# EAGLE schematic Domino Qi (EAGLE 6.5.0)
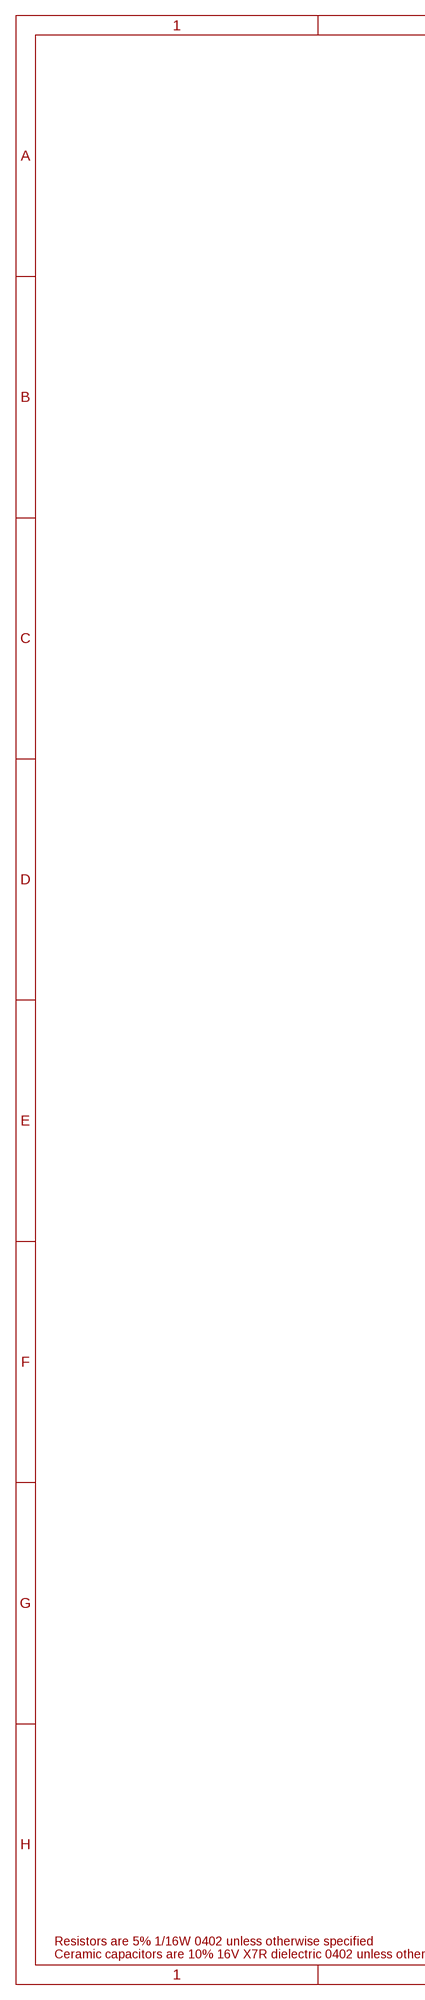
[diagram p0: schematic, sheet 1, part 1 of 2]
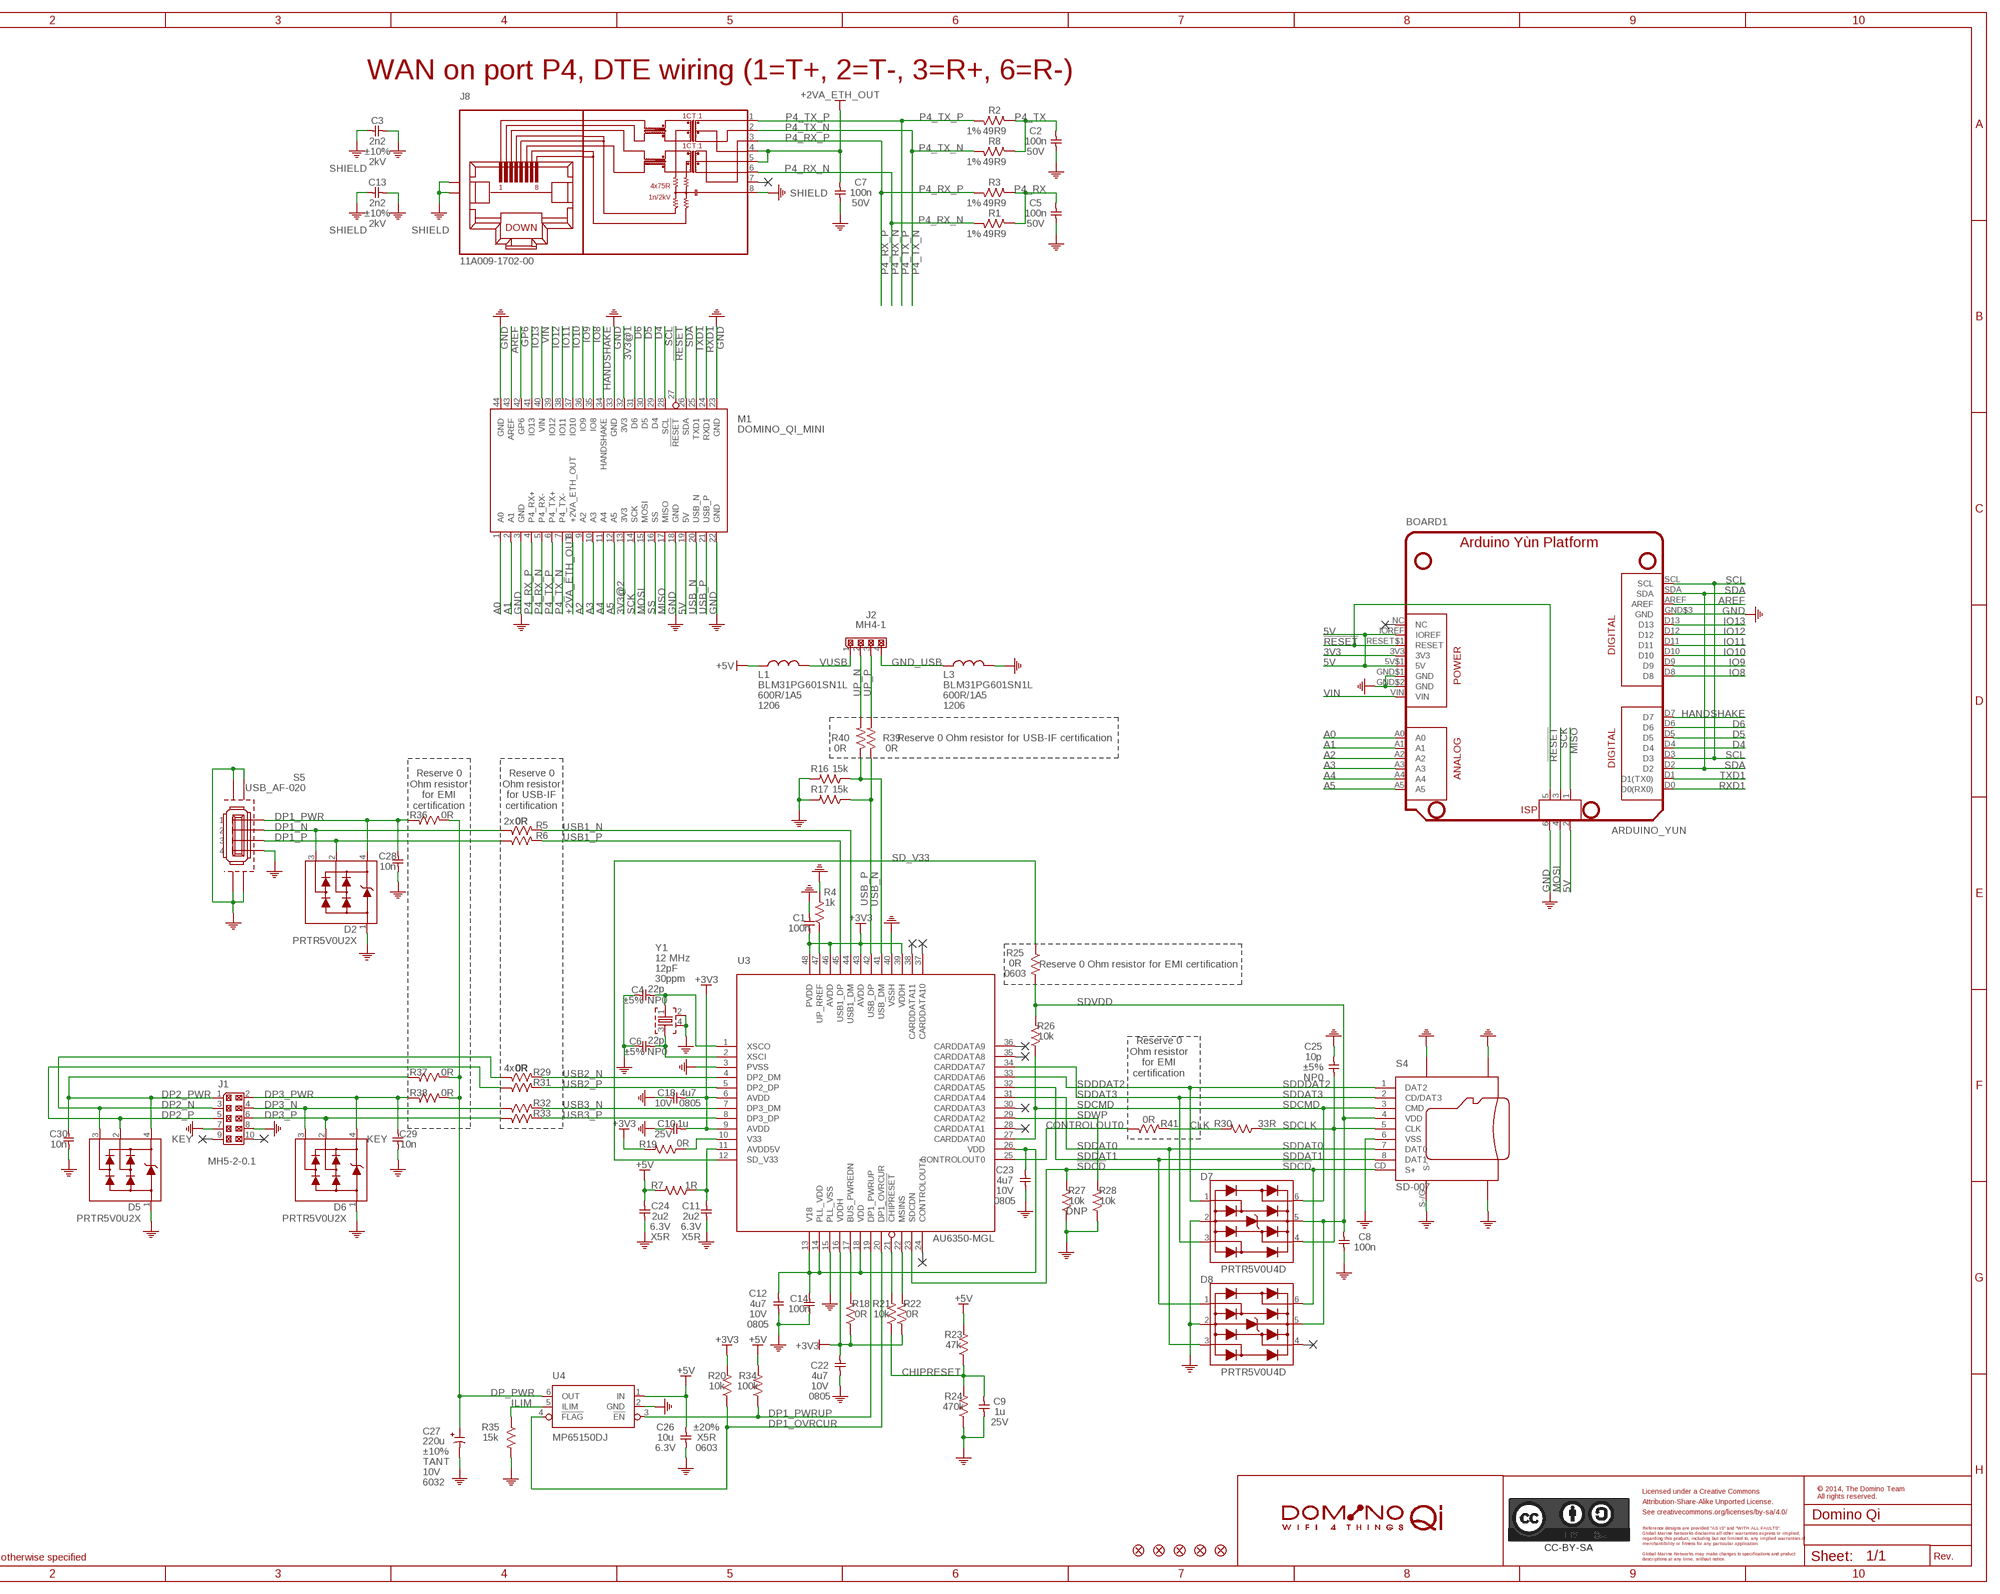
[diagram p1: schematic, sheet 1, part 2 of 2]
PORT1 (NC): BOM: EXCLUDE
PORT2 (NC): BOM: EXCLUDE
PORT3 (NC): BOM: EXCLUDE
PORT4 (NC): BOM: EXCLUDE
PORT5 (NC): BOM: EXCLUDE
PORT6 (NC): BOM: EXCLUDE
PORT7 (NC): BOM: EXCLUDE
PORT8 (NC): BOM: EXCLUDE
PORT9 (NC): BOM: EXCLUDE
PORT10 (NC): BOM: EXCLUDE
PORT11 (NC): BOM: EXCLUDE
PORT35 (NC): BOM: EXCLUDE

## Parts
BOARD1  ARDUINO_YUN  [ARDUINO-YUN-PLATFORM]
C1  100n  CAP_0402  [C0402]
C2  100n  CAP_0402  [C0402]
C3  2n2  CAP_1206  [C1206]
C4  22p  CAP_0402  [C0402]
C5  100n  CAP_0402  [C0402]
C6  22p  CAP_0402  [C0402]
C7  100n  CAP_0402  [C0402]
C8  100n  CAP_0402  [C0402]
C9  1u  CAP_0402  [C0402]
C10  1u  CAP_0402  [C0402]
C11  2u2  CAP_0402  [C0402]
C12  4u7  CAP_0805  [C0805]
C13  2n2  CAP_1206  [C1206]
C14  100n  CAP_0402  [C0402]
C18  4u7  CAP_0805  [C0805]
C22  4u7  CAP_0805  [C0805]
C23  4u7  CAP_0805  [C0805]
C24  2u2  CAP_0402  [C0402]
C25  10p  CAP_0402  [C0402]
C26  10u  CAP_0603  [C0603]
C27  220u  CPOL_C/6032-25  [C/6032-25]
C28  10n  CAP_0402  [C0402]
C29  10n  CAP_0402  [C0402]
C30  10n  CAP_0402  [C0402]
D2  PRTR5V0U2X  [SOT143B]
D5  PRTR5V0U2X  [SOT143B]
D6  PRTR5V0U2X  [SOT143B]
D7  PRTR5V0U4D  [SOT23-6]
D8  PRTR5V0U4D  [SOT23-6]
F1  FIDUCIAL  [FIDUCIAL]
F2  FIDUCIAL  [FIDUCIAL]
F4  FIDUCIAL  [FIDUCIAL]
F5  FIDUCIAL  [FIDUCIAL]
F6  FIDUCIAL  [FIDUCIAL]
J1  MH5-2-0.1  MH5-2  [MH05-2-0.1]
J2  MH4-1  [MH4-1-0.1]
J8  11A009-1702-00  [11A009-1702-00]
L1  BLM31PG601SN1L  FB_1206  [FB1206]
L3  BLM31PG601SN1L  FB_1206  [FB1206]
M1  DOMINO_QI_MINI  [DOMINO_QI_MINI]
R1  49R9  RES_0402  [R0402]
R2  49R9  RES_0402  [R0402]
R3  49R9  RES_0402  [R0402]
R4  1k  RES_0402  [R0402]
R5  0R  RES_0402  [R0402]
R6  0R  RES_0402  [R0402]
R7  1R  RES_0402  [R0402]
R8  49R9  RES_0402  [R0402]
R16  15k  RES_0402  [R0402]
R17  15k  RES_0402  [R0402]
R18  0R  RES_0402  [R0402]
R19  0R  RES_0402  [R0402]
R20  10k  RES_0402  [R0402]
R21  10k  RES_0402  [R0402]
R22  0R  RES_0402  [R0402]
R23  47k  RES_0402  [R0402]
R24  470k  RES_0402  [R0402]
R25  0R  RES_0603  [R0603]
R26  10k  RES_0402  [R0402]
R27  10k  RES_0402  [R0402]
R28  10k  RES_0402  [R0402]
R29  0R  RES_0402  [R0402]
R30  33R  RES_0402  [R0402]
R31  0R  RES_0402  [R0402]
R32  0R  RES_0402  [R0402]
R33  0R  RES_0402  [R0402]
R34  100k  RES_0402  [R0402]
R35  15k  RES_0402  [R0402]
R36  0R  RES_0402  [R0402]
R37  0R  RES_0402  [R0402]
R38  0R  RES_0402  [R0402]
R39  0R  RES_0402  [R0402]
R40  0R  RES_0402  [R0402]
R41  0R  RES_0402  [R0402]
S4  SD-007  MICRO-SD  [SD-007]
S5  USB_AF-020  [USB_AF-020]
U3  AU6350-MGL  [LQFP-48_7X7]
U4  MP65150DJ  [SOT23-6]
U$2  CC-BY-SA_LOGO  [CC-BY-SA_LOGO]
U$13  DOMINO_QI_LOGO  [DOMINO_QI_LOGO]
Y1  12 MHz  CRYSTAL_2SH  [CRYSTAL_32X25]

## Nets
3V3: BOARD1.3V3
3V3@1: M1.32(3V3)
3V3@2: M1.13(3V3)
5V: BOARD1.2(5V) BOARD1.5V$1(5V) BOARD1.IOREF M1.19(5V)
!CHIPRESET: R21.2 U3.21(!CHIPRESET)
!RESET: BOARD1.5(RESET) BOARD1.RESET$1(RESET) M1.27(!RESET)
!SDCD: D8.6(I/O4) R27.2 S4.CD(S+) U3.23(SDCDN)
+2VA_ETH_OUT [Ethernet0]: C7.2 J8.4 J8.5 M1.8(+2VA_ETH_OUT)
+3V3: C1.2 C10.2 C18.2 C22.2 R18.1 R19.2 R20.2 R22.1 U3.6(AVDD) U3.9(AVDD) U3.16(VDDH) U3.39(VDDH) U3.43(AVDD) U3.46(AVDD) U3.48(PVDD)
+5V: C24.1 C26.1 L1.2 R7.2 R23.2 R34.2 U4.1(IN)
A0: BOARD1.A0 M1.1(A0)
A1: BOARD1.A1 M1.2(A1)
A2: BOARD1.A2 M1.9(A2)
A3: BOARD1.A3 M1.10(A3)
A4: BOARD1.A4 M1.11(A4)
A5: BOARD1.A5 M1.12(A5)
AREF: BOARD1.AREF M1.43(AREF)
AVDD5V1: C11.1 R7.1 U3.11(AVDD5V)
BUS_PWREDN: R18.2 U3.17(BUS_PWREDN)
CHIPRESET: C9.1 R21.1 R23.1 R24.2
CLK: R30.2 R41.2
CONTROLOUT0: R41.1 U3.25(CONTROLOUT0)
D4: BOARD1.D4 M1.29(D4)
D5: BOARD1.D5 M1.30(D5)
D6: BOARD1.D6 M1.31(D6)
DP1_N [Ethernet]: D2.3 R5.1 S5.2
DP1_OVRCUR: R20.1 U3.20(DP1_OVRCUR) U4.4(!FLAG)
DP1_P [Ethernet]: D2.2 R6.1 S5.3
DP1_PWR: C28.1 D2.4 R36.1 S5.1
DP1_PWRUP: R34.1 U3.19(DP1_PWRUP) U4.3(!EN)
DP2_N [Ethernet]: D5.3 J1.3 R29.1
DP2_P [Ethernet]: D5.2 J1.5 R31.1
DP2_PWR: C30.1 D5.4 J1.1 R37.1
DP3_N [Ethernet]: D6.3 J1.4 R32.1
DP3_P [Ethernet]: D6.2 J1.6 R33.1
DP3_PWR: C29.1 D6.4 J1.2 R38.1
DP_PWR: C27.1(+) R36.2 R37.2 R38.2 U4.6(OUT)
GND: BOARD1.6(GND) BOARD1.GND$1(GND) BOARD1.GND$2(GND) BOARD1.GND$3(GND) C1.1 C2.1 C3.1 C4.1 C5.1 C6.1 C7.1 C8.2 C9.2 C10.1 C11.2 C12.1 C13.1 C14.2 C18.1 C22.1 C23.1 C24.2 C25.2 C26.2 C27.2(-) C28.2 C29.2 C30.2 D2.1 D5.1 D6.1 D7.2(GND) D8.2(GND) J1.7 J1.8 L3.1 M1.3(GND) M1.18(GND) M1.22(GND) M1.23(GND) M1.33(GND) M1.44(GND) R4.2 R16.2 R17.2 R24.1 R27.1 R28.1 R35.2 S4.6(VSS) S4.G$1(G) S4.G$2(G) S4.G$3(G) S4.S-/G(S-) S5.4 S5.G$1(G) S5.G$2(G) S5.G$3(G) S5.G$4(G) U3.3(PVSS) U3.15(PLL_VSS) U3.40(VSSH) U4.2(GND) Y1.2 Y1.4
GND_USB: J2.4 L3.2
GP6: M1.42(GP6)
HANDSHAKE: BOARD1.D7 M1.34(HANDSHAKE)
ILIM: R35.1 U4.5(ILIM)
IO8: BOARD1.D8 M1.35(IO8)
IO9: BOARD1.D9 M1.36(IO9)
IO10: BOARD1.D10 M1.37(IO10)
IO11: BOARD1.D11 M1.38(IO11)
IO12: BOARD1.D12 M1.39(IO12)
IO13: BOARD1.D13 M1.41(IO13)
MISO: BOARD1.1(MISO) M1.17(MISO)
MOSI: BOARD1.4(MOSI) M1.15(MOSI)
MSINS: R22.2 U3.22(MSINS)
P4_RX: C5.2 R1.1 R3.1
P4_RX_N [Ethernet]: J8.6 M1.5(P4_RX-) R1.2
P4_RX_P [Ethernet]: J8.3 M1.4(P4_RX+) R3.2
P4_TX: C2.2 R2.1 R8.1
P4_TX_N [Ethernet]: J8.2 M1.7(P4_TX-) R8.2
P4_TX_P [Ethernet]: J8.1 M1.6(P4_TX+) R2.2
RXD1: BOARD1.D0(D0(RX0)) M1.24(RXD1)
SCK: BOARD1.3(SCK) M1.14(SCK)
SCL: BOARD1.D3 BOARD1.SCL M1.28(SCL)
SD_V33: R25.1 U3.12(SD_V33)
SDA: BOARD1.D2 BOARD1.SDA M1.26(SDA)
SDCLK: C25.1 D7.4(I/O3) R30.1 S4.5(CLK)
SDCMD: D7.6(I/O4) R26.1 S4.3(CMD) U3.27(CARDDATA0)
SDDAT0: D8.3(I/O2) S4.7(DAT0) U3.31(CARDDATA4)
SDDAT1: D8.1(I/O1) S4.8(DAT1) U3.32(CARDDATA5)
SDDAT3: D7.3(I/O2) S4.2(CD/DAT3) U3.34(CARDDATA7)
SDDDAT2: D7.1(I/O1) S4.1(DAT2) U3.33(CARDDATA6)
SDVDD: C8.1 D7.5(VCC) D8.5(VCC) R25.2 R26.2 S4.4(VDD)
SDWP: R28.2 U3.29(CARDDATA2)
SHIELD: C3.2 C13.2 J8.8 J8.SH$1(SHIELD) J8.SH$2(SHIELD)
SS: M1.16(SS)
TXD1: BOARD1.D1(D1(TX0)) M1.25(TXD1)
UP_N [Ethernet]: J2.2 R40.2
UP_P [Ethernet]: J2.3 R39.2
UP_PREF: R4.1 U3.47(UP_RREF)
USB1_N [Ethernet]: R5.2 U3.44(USB1_DM)
USB1_P [Ethernet]: R6.2 U3.45(USB1_DP)
USB2_N [Ethernet]: R29.2 U3.4(DP2_DM)
USB2_P [Ethernet]: R31.2 U3.5(DP2_DP)
USB3_N [Ethernet]: R32.2 U3.7(DP3_DM)
USB3_P [Ethernet]: R33.2 U3.8(DP3_DP)
USB_N [Ethernet]: M1.20(USB_N) R16.1 R40.1 U3.41(USB_DM)
USB_P [Ethernet]: M1.21(USB_P) R17.1 R39.1 U3.42(USB_DP)
V1: R19.1 U3.10(V33)
V18: C12.2 C14.1 C23.2 U3.13(V18) U3.14(PLL_VDD) U3.18(VDD) U3.26(VDD)
VIN: BOARD1.VIN M1.40(VIN)
VUSB: J2.1 L1.1
XSCI: C6.2 U3.2(XSCI) Y1.3
XSCO: C4.2 U3.1(XSCO) Y1.1
Unconnected: BOARD1.NC D8.4(I/O3) J1.9 J1.10 J8.7 U3.24(CONTROLOUT1) U3.28(CARDDATA1) U3.30(CARDDATA3) U3.35(CARDDATA8) U3.36(CARDDATA9) U3.37(CARDDATA10) U3.38(CARDDATA11)

## Notes on the sheet
- WAN on port P4, DTE wiring (1=T+, 2=T-, 3=R+, 6=R-)
- Reserve 0 Ohm resistor for USB-IF certification
- Reserve 0
  Ohm resistor
  for EMI
  certification
- Reserve 0
  Ohm resistor
  for USB-IF
  certification
- 2x
- Reserve 0 Ohm resistor for EMI certification
- Reserve 0
  Ohm resistor
  for EMI
  certification
- 4x
- KEY | KEY
- Licensed under a Creative Commons
- © 2014, The Domino Team
  All rights reserved.
- Attribution-Share-Alike Unported License.
- See creativecommons.org/licenses/by-sa/4.0/
- Reference designs are provided "AS IS" and "WITH ALL FAULTS".
- Global Marine Networks disclaims all other warranties express or implied,
- regarding this product, including but not limited to, any implied warranties of
- merchantibility or fitness for any particular application.
- Resistors are 5% 1/16W 0402 unless otherwise specified
- Global Marine Networks may make changes to specifications and product
- Ceramic capacitors are 10% 16V X7R dielectric 0402 unless otherwise specified | descriptions at any time, without notice. | Rev.

## Library data of the parts
BOARD1 = Domino:ARDUINO_YUN: Arduino Yùn Platform
C1 C2 C5 C7 C8 C14 = Domino:CAP_: Capacitor; PARTNO: C0402_100n_X7R_10%_CER_50V; SIZE: 0402; TC: X7R; TOL: ±10%; TYPE: CER; VOLT: 50V
C3 C13 = Domino:CAP_: Capacitor; PARTNO: C1210_2n2_X7R_10%_CER_2kV; SIZE: 1206; TC: X7R; TOL: ±10%; TYPE: CER; VOLT: 2kV
C4 C6 = Domino:CAP_: Capacitor; PARTNO: C0402_22p_NP0_5%_CER_50V; SIZE: 0402; TC: NP0; TOL: ±5%; TYPE: CER; VOLT: 50V
C9 C10 = Domino:CAP_: Capacitor; PARTNO: C0402_1u_X7R_10%_CER_25V; SIZE: 0402; TC: X7R; TOL: ±10%; TYPE: CER; VOLT: 25V
C11 C24 = Domino:CAP_: Capacitor; PARTNO: C0402_2u2_X5R_10%_CER_6V3; SIZE: 0402; TC: X5R; TOL: ±10%; TYPE: CER; VOLT: 6.3V
C12 C18 C22 C23 = Domino:CAP_: Capacitor; PARTNO: C0805_4u7_X7R_10%_CER_6V3; SIZE: 0805; TC: X7R; TOL: 10%; TYPE: CER; VOLT: 10V
C25 = Domino:CAP_: Capacitor; PARTNO: C0402_10p_NP0_5%_CER_50V; SIZE: 0402; TC: NP0; TOL: ±5%; TYPE: CER; VOLT: 50V
C26 = Domino:CAP_: Capacitor; PARTNO: C0603_10u_X5R_20%_CER_6V3; SIZE: 0603; TC: X5R; TOL: ±20%; TYPE: CER; VOLT: 6.3V
C27 = Domino:CPOL_?*: Polarized Capacitor; PARTNO: CPOLC-6032_220u_20%_TANT_10V; SIZE: 6032; TOL: ±10%; TYPE: TANT; VOLT: 10V
C28-C30 = Domino:CAP_: Capacitor; PARTNO: C0402_10n_X7R_10%_CER_50V; SIZE: 0402; TC: X7R; TOL: ±10%; TYPE: CER; VOLT: 50V
D2 D5 D6 = Domino:PRTR5V0U2X: Ultra low capacitance double rail-to-rail ESD protection diode; PARTNO: PRTR5V0U2X
D7 D8 = Domino:PRTR5V0U4D: Ultra low capacitance quadruple rail-to-rail ESD protection; PARTNO: PRTR5V0U4D
F1 F2 F4-F6 = Domino:FIDUCIAL: Fiducial Mark; BOM: EXCLUDE
J1 = Domino:MH5-2: 2x5 Pin Male Header; PARTNO: MH5-2-0.1
J2 = Domino:MH4-1: 4x1 Pin Male Header; PARTNO: MH4-1-0.1
J8 = Domino:11A009-1702-00: Single Port RJ45 Modular Jack with Integrated Magnetics, no LED, 2 Shield Tabs; PARTNO: 11A009-1702-00
L1 L3 = Domino:FB_: Ferrite Bead; OPT: 600R/1A5; PARTNO: BLM31PG601SN1L; SIZE: 1206
M1 = Domino:DOMINO_QI_MINI: Domino Qi Mini WiFi Module
R1-R3 R8 = Domino:RES_: Resistor; PARTNO: R0402_49R9_1%_62.5mW; RATE: 62.5mW; SIZE: 0402; TOL: 1%
R4 = Domino:RES_: Resistor; PARTNO: R0402_1k_5%_62.5mW; RATE: 62.5mW; SIZE: 0402; TOL: 5%
R5 R6 R18 R22 R29 R31-R33 R36-R41 = Domino:RES_: Resistor; PARTNO: R0402_0R_5%_62.5mW; RATE: 62.5mW; SIZE: 0402; TOL: 5%
R7 = Domino:RES_: Resistor; PARTNO: R0402_1R_5%_62.5mW; RATE: 62.5mW; SIZE: 0402; TOL: 5%
R16 R17 R35 = Domino:RES_: Resistor; PARTNO: R0402_15k_5%_62.5mW; RATE: 62.5mW; SIZE: 0402; TOL: 5%
R19 = Domino:RES_: Resistor; PARTNO: R0402_0R_5%_62.5mW; RATE: 125mW; SIZE: 0402; TOL: 5%
R20 R21 R26 R28 = Domino:RES_: Resistor; PARTNO: R0402_10k_5%_62.5mW; RATE: 62.5mW; SIZE: 0402; TOL: 5%
R23 = Domino:RES_: Resistor; PARTNO: R0402_47k_5%_62.5mW; RATE: 62.5mW; SIZE: 0402; TOL: 5%
R24 = Domino:RES_: Resistor; PARTNO: R0402_470k_5%_62.5mW; RATE: 62.5mW; SIZE: 0402; TOL: 5%
R25 = Domino:RES_: Resistor; PARTNO: R0603_0R_5%_125mW; RATE: 125mW; SIZE: 0603; TOL: 5%
R27 = Domino:RES_: Resistor; DNP: T; PARTNO: R0402_10k_5%_62.5mW; RATE: 62.5mW; SIZE: 0402; TOL: 5%
R30 = Domino:RES_: Resistor; PARTNO: R0402_33R_5%_62.5mW; RATE: 62.5mW; SIZE: 0402; TOL: 5%
R34 = Domino:RES_: Resistor; PARTNO: R0402_100k_5%_62.5mW; RATE: 62.5mW; SIZE: 0402; TOL: 5%
S4 = Domino:MICRO-SD: Micro SD Memory Card Connector, With Card Detect Switch; PARTNO: SD-007
S5 = Domino:USB_AF-020: USB Type A Socket; PARTNO: USB_AF-020
U3 = Domino:AU6350-MGL: USB2.0 Hub-Reader Controller; PARTNO: AU6350-MGL
U4 = Domino:MP65150DJ: Precision 60mA-1.7A Programmable Current-Limited Power Distribution Switch; PARTNO: MP65150DJ
U$2 = Domino:CC-BY-SA_LOGO: Attribution-Share-Alike Unported License See creativecommons.org/licenses/by-sa/3.0/ for details.; BOM: EXCLUDE
U$13 = Domino:DOMINO_QI_LOGO: Domino Qi Logo; BOM: EXCLUDE
Y1 = Domino:CRYSTAL_2SH: Crystal with 2 Shield Pins; LOAD: 12pF; PARTNO: CRYSTAL_32X25_2SH_12PF_30PPM; TOL: 30ppm

## Net classes
1 Ethernet: width 0.254 mm, clearance 0.152 mm to class 0, clearance 0.152 mm
2 RF: width 0.66 mm, clearance 0.152 mm
3 Ethernet0: width 0.254 mm, clearance 0.152 mm to class 0, clearance 0.152 mm to class 1, clearance 0.152 mm to class 2, clearance 0.152 mm